# EAGLE schematic HURCBiomechSockSchematic (EAGLE 9.6.2)
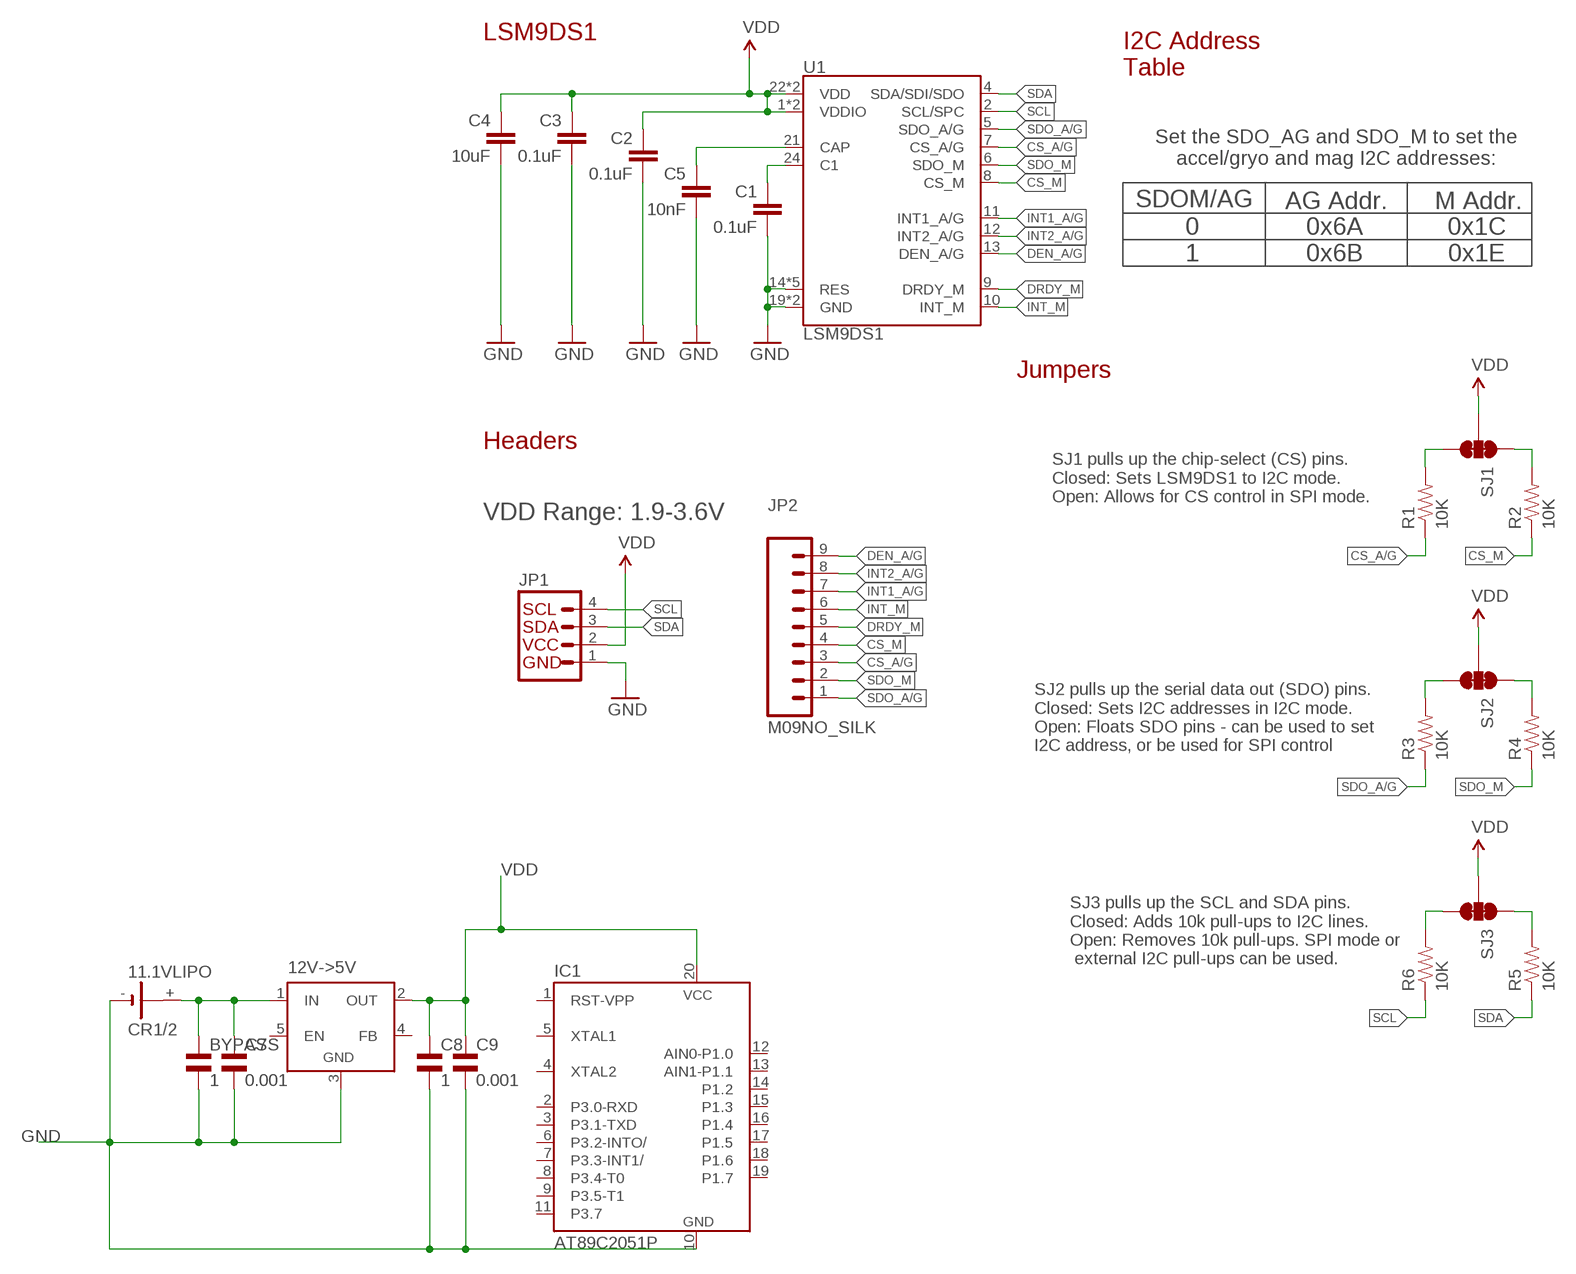
[diagram p0: schematic, sheet 1]

## Parts
11.1VLIPO  CR1/2  [CR1/2]
12V->5V  LM2596TV  [TO220-51]
BYPASS  1  EL-BI25-10AXIAL  [EU25-10]
C1  0.1uF  0.1UF-25V(+80/-20%)(0603)  [0603-CAP]
C2  0.1uF  0.1UF-25V(+80/-20%)(0603)  [0603-CAP]
C3  0.1uF  0.1UF-25V(+80/-20%)(0603)  [0603-CAP]
C4  10uF  10UF-6.3V-20%(0603)  [0603-CAP]
C5  10nF  10NF/10000PF-50V-10%(0603)  [0603-CAP]
C7  0.001  EL-BI25-10AXIAL  [EU25-10]
C8  1  EL-BI25-10AXIAL  [EU25-10]
C9  0.001  EL-BI25-10AXIAL  [EU25-10]
IC1  AT89C2051P  [DIL20]
JP1  I2C_STANDARD_NO_SILK  [1X04_NO_SILK]
JP2  M09NO_SILK  [1X09_NO_SILK]
R1  10K  10KOHM-1/10W-1%(0603)0603  [0603-RES]
R2  10K  10KOHM-1/10W-1%(0603)0603  [0603-RES]
R3  10K  10KOHM-1/10W-1%(0603)0603  [0603-RES]
R4  10K  10KOHM-1/10W-1%(0603)0603  [0603-RES]
R5  10K  10KOHM-1/10W-1%(0603)0603  [0603-RES]
R6  10K  10KOHM-1/10W-1%(0603)0603  [0603-RES]
SJ1  JUMPER-PAD-3-NC_BY_TRACE  [PAD-JUMPER-3-3OF3_NC_BY_TRACE_YES_SILK_FULL_BOX]
SJ2  JUMPER-PAD-3-NC_BY_TRACE  [PAD-JUMPER-3-3OF3_NC_BY_TRACE_YES_SILK_FULL_BOX]
SJ3  JUMPER-PAD-3-NC_BY_TRACE  [PAD-JUMPER-3-3OF3_NC_BY_TRACE_YES_SILK_FULL_BOX]
U1  LSM9DS1  [LGA24-8X4]

## Nets
C1: C1.1 U1.24(C1)
CAP: C5.1 U1.21(CAP)
CS_A/G: JP2.3 R1.1 U1.7(CS_A/G)
CS_A/G_PU: R1.2 SJ1.3
CS_M: JP2.4 R2.1 U1.8(CS_M)
CS_M_PU: R2.2 SJ1.1
DEN_A/G: JP2.9 U1.13(DEN_A/G)
DRDY_M: JP2.5 U1.9(DRDY_M)
GND: 11.1VLIPO.- 12V->5V.3(GND) BYPASS.2 C1.2 C2.2 C3.2 C4.2 C5.2 C7.2 C8.2 C9.2 IC1.10(GND) JP1.1 U1.14(RES) U1.15(RES) U1.16(RES) U1.17(RES) U1.18(RES) U1.19(GND) U1.20(GND)
INT1_A/G: JP2.7 U1.11(INT1_A/G)
INT2_A/G: JP2.8 U1.12(INT2_A/G)
INT_M: JP2.6 U1.10(INT_M)
N$1: 11.1VLIPO.+ 12V->5V.1(IN) BYPASS.1 C7.1
SCL: JP1.4 R6.1 U1.2(SCL/SPC)
SCL_PU: R6.2 SJ3.3
SDA: JP1.3 R5.1 U1.4(SDA/SDI/SDO)
SDA_PU: R5.2 SJ3.1
SDO_A/G: JP2.1 R3.1 U1.5(SDO_A/G)
SDO_A/G_PU: R3.2 SJ2.3
SDO_M: JP2.2 R4.1 U1.6(SDO_M)
SDO_M_PU: R4.2 SJ2.1
VDD: 12V->5V.2(OUT) C2.1 C3.1 C4.1 C8.1 C9.1 IC1.20(VCC) JP1.2 SJ1.2 SJ2.2 SJ3.2 U1.1(VDDIO) U1.3(VDDIO) U1.22(VDD) U1.23(VDD)
Unconnected: 11.1VLIPO.+@1(+) 12V->5V.4(FB) 12V->5V.5(EN) IC1.1(RST-VPP) IC1.2(P3.0-RXD) IC1.3(P3.1-TXD) IC1.4(XTAL2) IC1.5(XTAL1) IC1.6(P3.2-INTO/) IC1.7(P3.3-INT1/) IC1.8(P3.4-T0) IC1.9(P3.5-T1) IC1.11(P3.7) IC1.12(AIN0-P1.0) IC1.13(AIN1-P1.1) IC1.14(P1.2) IC1.15(P1.3) IC1.16(P1.4) IC1.17(P1.5) IC1.18(P1.6) IC1.19(P1.7)

## Notes on the sheet
- LSM9DS1
- I2C Address
  Table
- Set the SDO_AG and SDO_M to set the
  accel/gryo and mag I2C addresses:
- SDOM/AG | AG Addr. | M Addr.
- 0
  1
- 0x6A
  0x6B
- 0x1C
  0x1E
- Jumpers
- Headers
- SJ1 pulls up the chip-select (CS) pins.
  Closed: Sets LSM9DS1 to I2C mode.
  Open: Allows for CS control in SPI mode.
- VDD Range: 1.9-3.6V
- SJ2 pulls up the serial data out (SDO) pins.
  Closed: Sets I2C addresses in I2C mode.
  Open: Floats SDO pins - can be used to set
  I2C address, or be used for SPI control
- SJ3 pulls up the SCL and SDA pins.
  Closed: Adds 10k pull-ups to I2C lines.
  Open: Removes 10k pull-ups. SPI mode or
   external I2C pull-ups can be used.

## Library data of the parts
11.1VLIPO = battery:CR1/2: LI BATTERY Sonnenschein SL-350 PT
12V->5V = linear:LM2596T: STEP-DOWN VOLTAGE REGULATOR
BYPASS C7-C9 = rcl:EL-: BIPOLAR ELECTROLYTIC CAPACITOR; SPICEPREFIX: C
C1-C3 = SparkFun-Capacitors:0.1UF-25V(+80/-20%)(0603): CAP-00810 Ceramic Standard decoupling cap; PROD_ID: CAP-00810
C4 = SparkFun-Capacitors:10UF-6.3V-20%(0603): CAP-11015; PROD_ID: CAP-11015
C5 = SparkFun-Capacitors:10NF/10000PF-50V-10%(0603): CAP-00867; PROD_ID: CAP-00867
IC1 = atmel:AT89C2051: 80C31 MICROCONTROLLER 2 Kbytes FLASH 2.7 V; MPN: AT89C2051-12PU; OC_FARNELL: 1699389; OC_NEWARK: 80P3687
JP1 = SparkFun-Connectors:I2C_STANDARD: SparkFun has standardized on a pinout for all I2C based sensor breakouts. This pinout allows I2C boards to be plugged directly into the headers on Arduino Uno compatible boards, and to be daisy chained easily.
JP2 = SparkFun-Connectors:M09: Header 9 Standard 9-pin 0.1" header. Use with straight break away headers (SKU : PRT-00116), right angle break away headers (PRT-00553), swiss pins (PRT-00743), machine pins (PRT-00117), and female headers (PRT-00115).
R1-R6 = SparkFun-Resistors:10KOHM-1/10W-1%(0603): RES-00824; PROD_ID: RES-00824
SJ1-SJ3 = SparkFun-Passives:JUMPER-PAD-3-NC_BY_TRACE
U1 = LSM9DS1_temp:LSM9DS1: LSM9DS1 3D accelerometer, gyroscope & magnetometer The LSM9DS1 is a system-in-package featuring a 3D digital linear acceleration sensor, a 3D digital angular rate sensor, and a 3D digital magnetic sensor. The LSM9DS1 has a linear acceleration full scale of ±2g/±4g/±8/±16 g, a magnetic field full scale of ±4/±8/±12/±16 gauss and an angular rate of ±245/±500/±2000 dps. The LSM9DS1 includes an I2 C serial bus interface supporting standard and fast mode (100 kHz and 400 kHz) and an SPI serial standard interface. Magnetic, accelerometer and gyroscope sensing can be enabled or set in power-down mode separately for smart power management. The LSM9DS1 is available in a plastic land grid array package (LGA) and it is guaranteed to operate over an extended temperature range from -40 °C to +85 °C.; PROD_ID: IC-12536